# EAGLE design LCD_I2C (EAGLE 9.5.2)
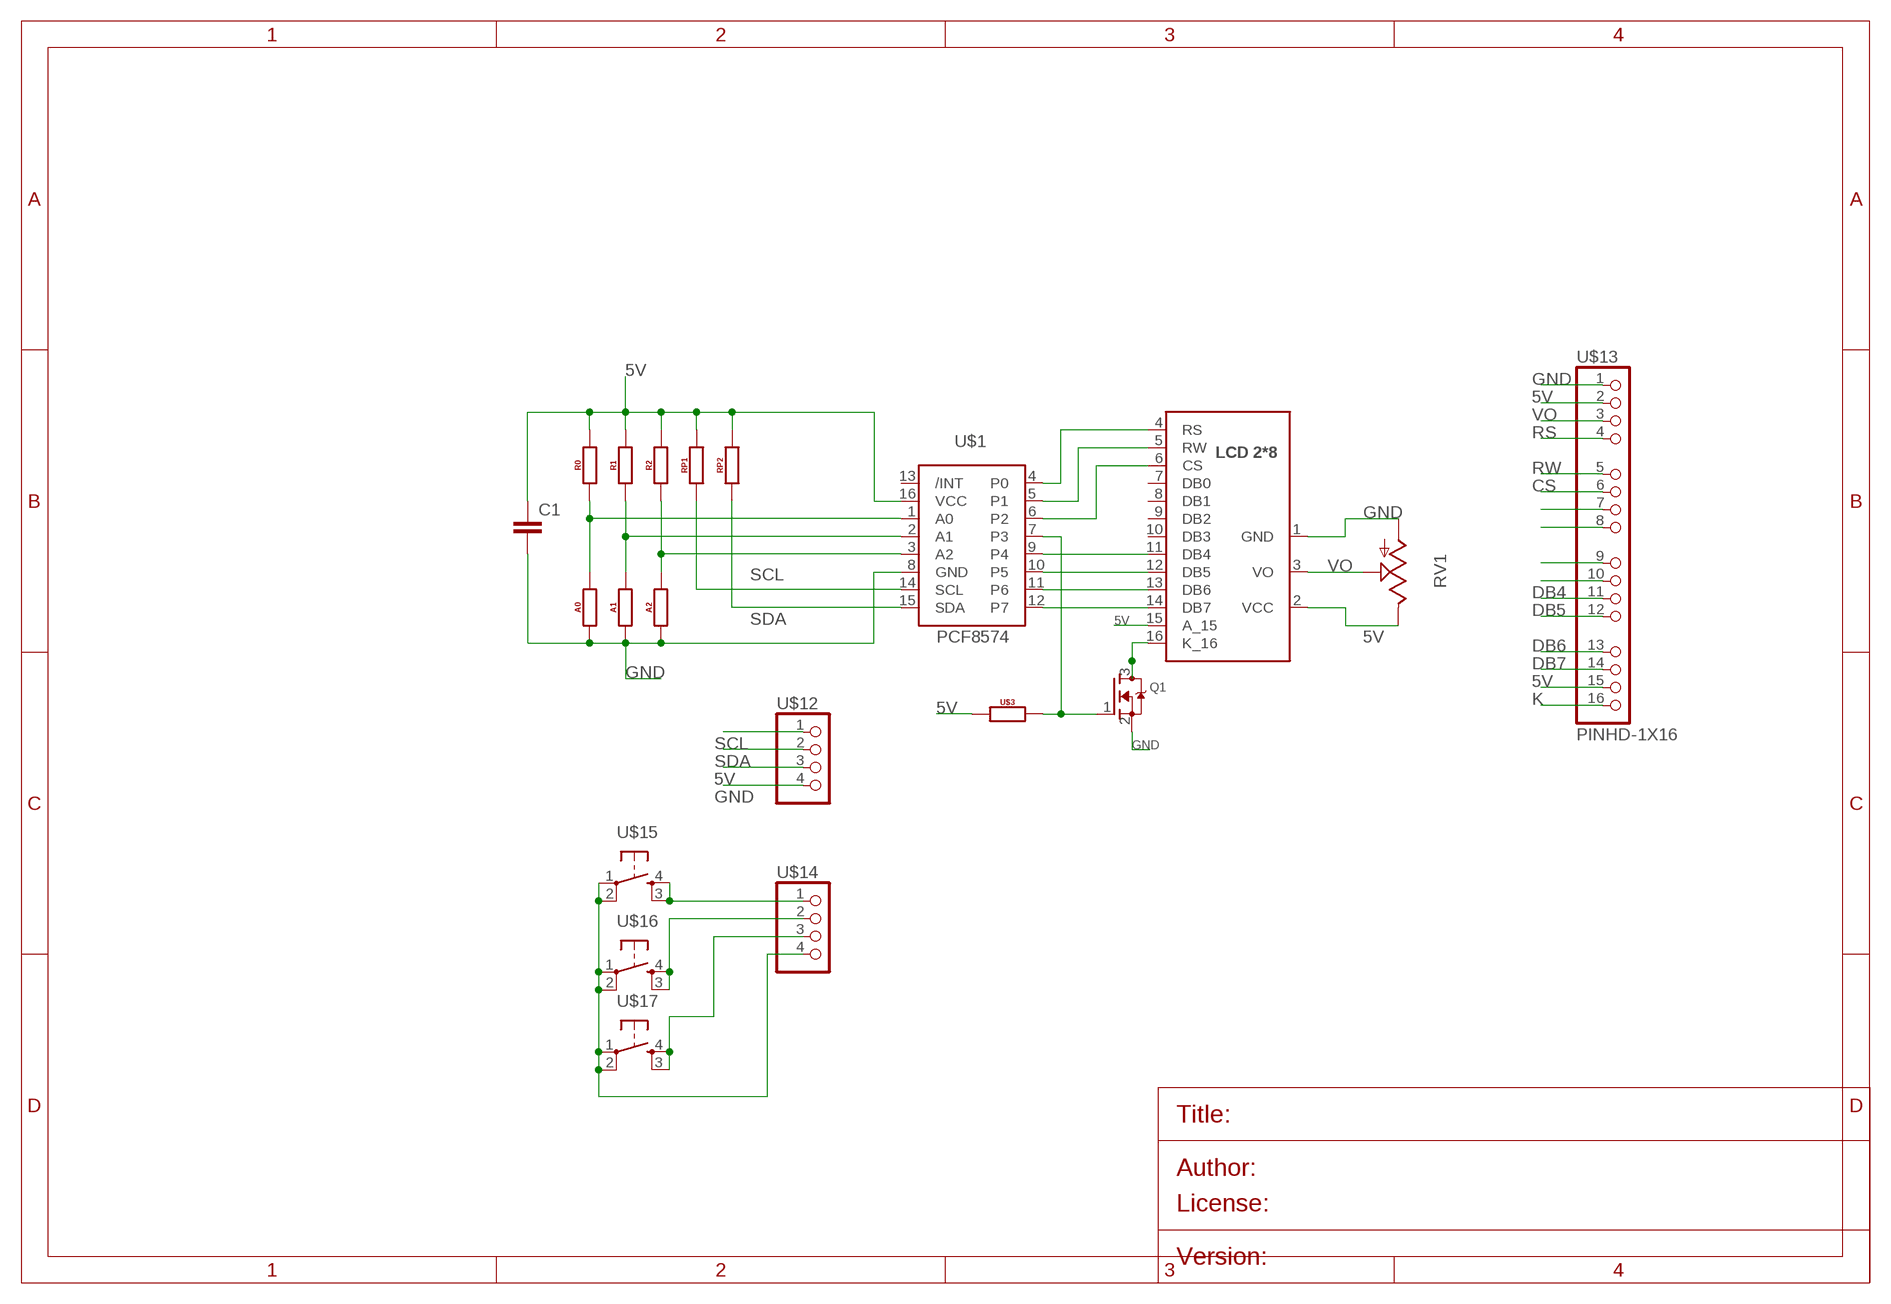
[diagram p0: schematic, sheet 1]

## Parts
A0  RESISTOR0805  [0805]
A1  RESISTOR0805  [0805]
A2  RESISTOR0805  [0805]
C1  CAPACITOR0805  [0805]
Q1  MOSFET-N  [SOT23-WIDE]
R0  RESISTOR0805  [0805]
R1  RESISTOR0805  [0805]
R2  RESISTOR0805  [0805]
RP1  RESISTOR0805  [0805]
RP2  RESISTOR0805  [0805]
RV1  TRIM_POTB25P  [B25P]
U$1  PCF8574  [SOIC16]
U$2  LCD_28_A  [LCD_2*8_A]
U$3  RESISTOR0805  [0805]
U$12  PINHD-1X4_NO_SILK  [1X04_NO_SILK]
U$13  PINHD-1X16  [1X16_NO_SILK]
U$14  PINHD-1X4_NO_SILK  [1X04_NO_SILK]
U$15  TACTILE_BUTTON_SMD  [TACTILE-BUTTON-SMD]
U$16  TACTILE_BUTTON_SMD  [TACTILE-BUTTON-SMD]
U$17  TACTILE_BUTTON_SMD  [TACTILE-BUTTON-SMD]

## Nets
5V [PWR]: C1.1 R0.2 R1.2 R2.2 RP1.2 RP2.2 RV1.E U$1.16(VCC) U$2.2(VCC) U$2.15(A_15) U$3.1 U$12.3 U$13.2 U$13.15
CS: U$1.6(P2) U$2.6(CS) U$13.6
DB4: U$1.9(P4) U$2.11(DB4) U$13.11
DB5: U$1.10(P5) U$2.12(DB5) U$13.12
DB6: U$1.11(P6) U$2.13(DB6) U$13.13
DB7: U$1.12(P7) U$2.14(DB7) U$13.14
GND [PWR]: A0.1 A1.1 A2.1 C1.2 Q1.2(S) RV1.A U$1.8(GND) U$2.1(GND) U$12.4 U$13.1
K: Q1.3(D) U$2.16(K_16) U$13.16
N$1: U$14.4 U$15.1(SWA1) U$15.2(SWB1) U$16.1(SWA1) U$16.2(SWB1) U$17.1(SWA1) U$17.2(SWB1)
N$2: U$14.1 U$15.3(SWB2) U$15.4(SWA2)
N$3: U$14.2 U$16.3(SWB2) U$16.4(SWA2)
N$4: A0.2 R0.1 U$1.1(A0)
N$5: U$14.3 U$17.3(SWB2) U$17.4(SWA2)
N$10: Q1.1(G) U$1.7(P3) U$3.2
N$11: A1.2 R1.1 U$1.2(A1)
N$13: A2.2 R2.1 U$1.3(A2)
N$20: U$13.7
N$21: U$13.8
N$22: U$13.9
N$23: U$13.10
RS: U$1.4(P0) U$2.4(RS) U$13.4
RW: U$1.5(P1) U$2.5(RW) U$13.5
SCL: RP1.1 U$1.14(SCL) U$12.1
SDA: RP2.1 U$1.15(SDA) U$12.2
VO: RV1.S U$2.3(VO) U$13.3
Unconnected: U$1.13(/INT) U$2.7(DB0) U$2.8(DB1) U$2.9(DB2) U$2.10(DB3)

## Library data of the parts
A0 A1 A2 R0 R1 R2 RP1 RP2 U$3 = flash_pow3:RESISTOR: Generic EU resistor symbol
C1 = flash_pow3:CAPACITOR: CAPACITOR, European symbol
Q1 = flash_pow3:MOSFET-N: N-Channel Mosfet 2N7002E - 60V 260mA SOT23 [Digikey: 2N7002ET1GOSTR-ND] - REEL BSH103 - 30V 850mA SOT23 [Digikey: 568-5013-1-ND]
RV1 = flash_pow3:TRIM_POT: POTENTIOMETER
U$1 = flash_pow3:PCF8574: Remote 8-Bit I/O Expander for I²C Bus
U$2 = flash_pow3:LCD_2*8_A: LCD WINSTAR 2x8 with controller. (Pads 1 to 16 are spaced symmetrically by horizontal axis)
U$12 U$14 = flash_pow3:PINHD-1X4
U$13 = flash_pow3:PINHD-1X16
U$15-U$17 = flash_pow3:TACTILE_BUTTON: Tactile Button SparkFun Electronics' Tactile Button COM-10302

## Net classes
1 PWR: width 0.3 mm

## Board
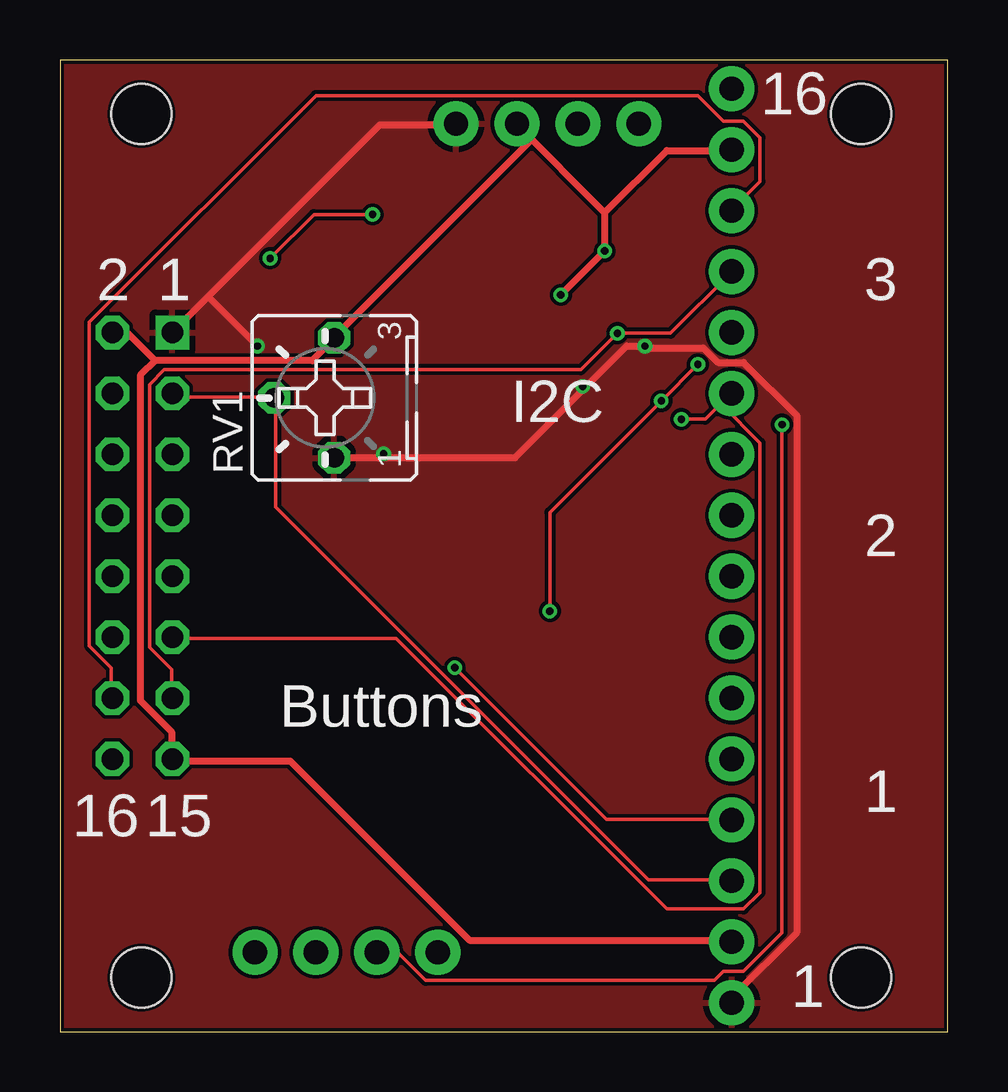
[diagram p1: board, top side]
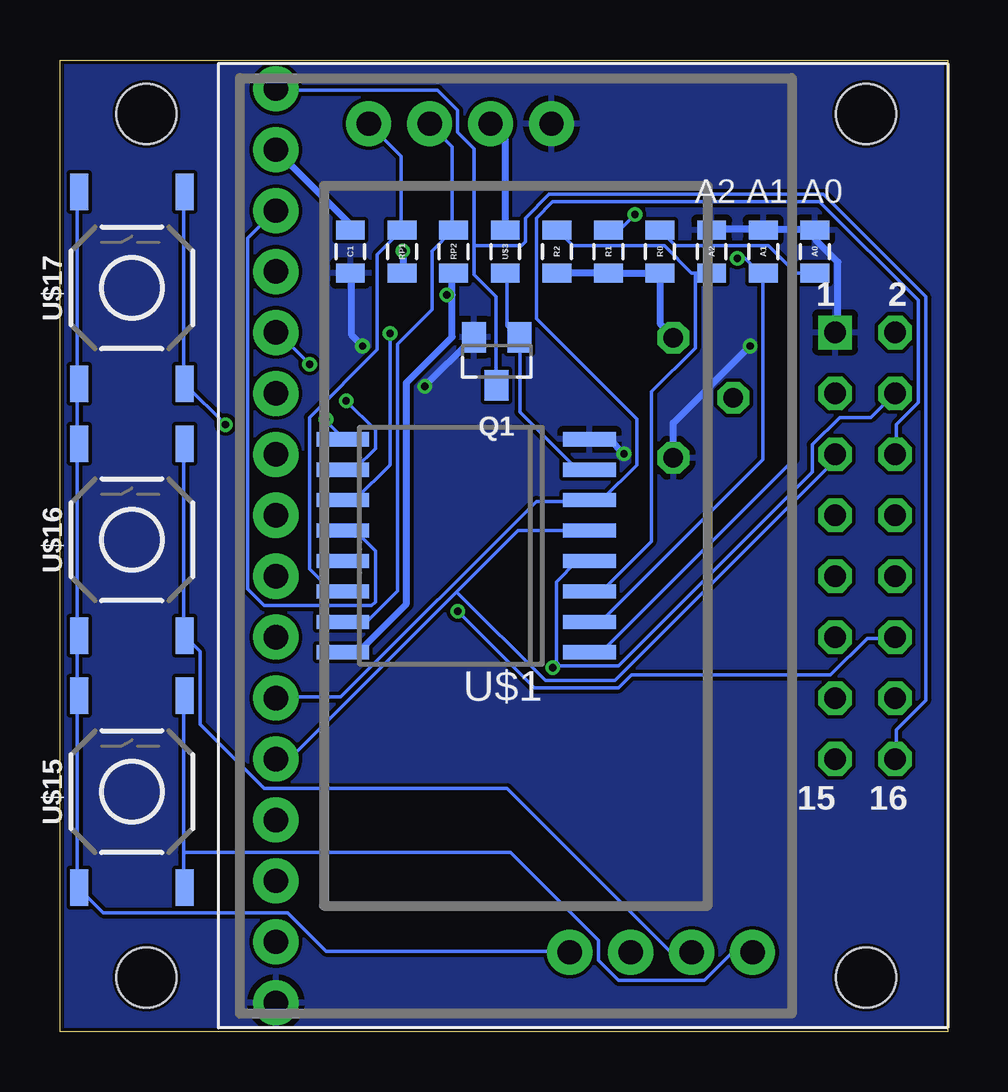
[diagram p2: board, bottom side, seen from below]

Size 37 x 40.5 mm. Coordinates in mm from the lower left corner, seen from the top.
Outline: 0,0 37,0 37,40.5 0,40.5 0,0
Copper layers (1*16): Top 0.035mm / dielectric 1.5mm / Bottom 0.035mm
Design rules "flash_boards.v281218": minimum track width 6mil, minimum drill 12mil, track to track 6mil, track to pad 6mil, pad to pad 6mil, via to via 6mil, smd to smd 0mil, copper to edge 6mil, drill to drill 6mil, minimum pad ring 10mil, minimum via ring 6mil, stop-mask expansion 2mil, vias tented up to drill 25mil, thermal gap 10mil

### Footprints (pad centres in the part's own frame; a part is rotated, then mirrored left to right if it is on the bottom)
0805 = smd 0.8 x 1.2: 1 -0.9,0; 2 0.9,0
SOT23-WIDE = smd 1 x 1.27: 1 -0.95,-1; 2 0.95,-1; 3 0,1
B25P = drill 0.813 octagon: A -2.5,0; E 2.5,0; S 0,2.5
SOIC16 = smd 0.6 x 2.2: 1 -4.445,-5.14; 2 -3.175,-5.14; 3 -1.905,-5.14; 4 -0.635,-5.14; 5 0.635,-5.14; 6 1.905,-5.14; 7 3.175,-5.14; 8 4.445,-5.14; 9 4.445,5.14; 10 3.175,5.14; 11 1.905,5.14; 12 0.635,5.14; 13 -0.635,5.14; 14 -1.905,5.14; 15 -3.175,5.14; 16 -4.445,5.14
LCD_2*8_A = drill 0.9 square: 1 -8.89,13.316 | drill 0.9 octagon: 2 -8.89,15.816; 3 -6.35,13.316; 4 -6.35,15.816; 5 -3.81,13.316; 6 -3.81,15.816; 7 -1.27,13.316; 8 -1.27,15.816; 9 1.27,13.316; 10 1.27,15.816; 11 3.81,13.316; 12 3.81,15.816; 13 6.35,13.316; 14 6.35,15.816; 15 8.89,13.316; 16 8.89,15.816 | hole 2.5: -18,14.605; -18,-15.395; 18,14.605; 18,-15.395
1X04_NO_SILK = drill 1.016 pad 1.88: 1 -3.81,0; 2 -1.27,0; 3 1.27,0; 4 3.81,0
1X16_NO_SILK = drill 1.016 pad 1.88: 1 -19.05,0; 2 -16.51,0; 3 -13.97,0; 4 -11.43,0; 5 -8.89,0; 6 -6.35,0; 7 -3.81,0; 8 -1.27,0; 9 1.27,0; 10 3.81,0; 11 6.35,0; 12 8.89,0; 13 11.43,0; 14 13.97,0; 15 16.51,0; 16 19.05,0
TACTILE-BUTTON-SMD = smd 1.524 x 0.762: 1 -4,2.2; 2 4,2.2; 3 -4,-2.2; 4 4,-2.2

### Placement (x,y rotation side)
A0  5.53,32.51 270 bottom
A1  7.68,32.51 270 bottom
A2  9.83,32.51 270 bottom
C1  24.89,32.51 270 bottom
Q1  18.8,27.94 180 bottom
R0  11.99,32.51 270 bottom
R1  14.14,32.51 270 bottom
R2  16.29,32.51 270 bottom
RP1  22.74,32.51 270 bottom
RP2  20.59,32.51 270 bottom
RV1  11.43,26.42 90 top
U$1  20.07,20.25 90 bottom
U$2  18,20.25 270 bottom
U$3  18.44,32.51 270 bottom
U$12  20.32,37.85 180 top
U$13  28,20.25 90 top
U$14  11.94,3.3 0 top
U$15  34,10 90 bottom
U$16  34,20.5 90 bottom
U$17  34,31 90 bottom

### Tracks (layer width: path | path; a pad name or v marks a point on that pad's centre or on a via)
5V  (via drill 0.3)
  Top 0.3: 22.71,34.14 v22.71,32.54 v20.88,30.71 | 22.71,34.14 19.05,37.8 U$12.3 19.58,37.11 11.51,29.03 RV1.E 11.43,28.88 10.52,27.96 3.96,27.96 | 22.71,34.14 25.3,36.73 27.96,36.73 U$13.15 | 3.96,27.96 2.82,29.11 2.21,29.11 U$2.2 | 3.96,27.96 3.35,27.36 3.35,13.79 4.65,12.5 4.65,11.43 U$2.15 4.8,11.28 9.6,11.28 17.07,3.81 27.96,3.81 U$13.2
  Bottom 0.3: 20.65,30.71 20.65,28.96 22.55,27.05 22.55,17.83 24.54,15.85 25.15,15.85 U$1.16 | 20.65,30.71 20.65,31.55 RP2.2 | C1.1 24.92,33.45 24.92,33.68 27.96,36.73 U$13.15 | v22.71,32.54 22.71,31.62 RP1.2 | U$3.1 18.44,33.45 18.44,37.19 19.05,37.8 U$12.3 | R2.2 16.23,31.62 14.25,31.62 R1.2 14.1,31.62 12.04,31.62 R0.2 11.96,31.47 11.96,29.49 11.43,28.96 RV1.E | v20.88,30.71 20.65,30.71
CS
  Bottom 0.152: U$13.6 27.96,13.95 25.3,13.95 17.14,22.1 14.94,22.1 U$1.6 14.86,22.17 14.4,22.17 12.95,23.62 12.95,25.53 17.14,29.72 17.14,33.91 16.46,34.59 5.33,34.59 1.22,30.48 1.22,26.21 2.13,25.3 2.13,24.08 U$2.6
DB4  (via drill 0.3)
  Top 0.152: v25.91,25.53 26.9,25.53 27.96,26.59 U$13.11 27.58,26.14 29.18,24.54 29.18,5.79 28.5,5.11 25.3,5.11 14.02,16.38 4.72,16.38 U$2.11
  Bottom 0.152: v25.91,25.53 25.91,25.45 25.22,24.77 U$1.9
DB5  (via drill 0.3)
  Top 0.152: v26.59,27.81 v25.07,26.29 20.42,21.64 v20.42,17.53
  Bottom 0.152: v25.07,26.29 23.85,25.07 23.85,24.31 24.69,23.47 25.15,23.47 U$1.10 | v26.59,27.81 27.96,29.18 U$13.12 | v20.42,17.53 17.22,14.33 13.72,14.33 13.18,14.86 4.88,14.86 3.35,16.38 2.21,16.38 U$2.12
DB6  (via drill 0.3)
  Top 0.152: U$13.13 27.96,31.62 25.45,29.11 v23.24,29.11 21.72,27.58 4.34,27.58 3.73,26.98 3.73,16 4.65,15.09 4.65,13.95 U$2.13
  Bottom 0.152: v23.24,29.11 23.24,23.62 24.69,22.17 25.15,22.17 U$1.11
DB7
  Top 0.152: U$2.14 2.13,13.95 2.13,15.16 1.22,16.08 1.22,29.57 10.67,39.01 26.59,39.01 27.66,37.95 28.5,37.95 29.18,37.26 29.18,35.43 28.04,34.29 U$13.14
  Bottom 0.152: U$1.12 25.15,20.88 24.69,20.88 23.85,20.04 23.85,17.91 24,17.75 28.5,17.75 29.18,18.44 29.18,33.07 28.04,34.21 U$13.14
GND  (via drill 0.3)
  Top 0.3: 6.17,30.63 4.72,29.18 U$2.1 | 6.17,30.63 13.34,37.8 16.46,37.8 U$12.4 | 21.87,26.82 18.97,23.93 13.49,23.93 | 21.87,26.82 23.62,28.57 v24.38,28.57 24.46,28.5 26.82,28.5 27.43,27.89 28.5,27.89 30.71,25.68 30.71,4.12 28.04,1.45 28.04,1.22 U$13.1 | 13.49,23.93 RV1.A | v21.79,26.9 21.87,26.82 | v13.49,24.08 13.49,23.93 | v8.23,28.57 6.17,30.63
  Bottom 0.3: A2.1 9.83,33.45 7.77,33.45 A1.1 7.62,33.45 5.56,33.45 A0.1 5.49,33.3 5.49,32.99 4.57,32.08 4.57,29.26 4.65,29.18 U$2.1 | v24.38,28.57 24.84,29.03 24.84,31.55 C1.2 | v21.79,26.9 19.81,28.88 Q1.2 | v13.49,24.08 14.1,24.69 14.86,24.69 U$1.8 | v8.23,28.57 11.43,25.38 RV1.A
  pour Top: 37.08,40.64 0,40.64 0,0.51 -0.51,0 37.08,0
  pour Bottom: 37.08,40.64 0.51,40.64 0,40.13 0,0 37.08,0
K
  Bottom 0.152: 19.74,32.77 19.74,36.8 20.42,37.49 20.42,38.41 21.26,39.24 27.96,39.24 U$13.16 | 19.74,32.77 19.74,31.55 18.82,30.63 18.82,26.98 Q1.3 | 19.74,32.77 17.75,32.77 17.6,32.92 17.6,33.91 16.61,34.9 5.18,34.9 0.91,30.63 0.91,13.79 2.13,12.57 2.13,11.43 U$2.16
N$1
  Bottom 0.152: U$17.2 36.27,34.98 36.27,27.05 U$17.1 36.27,26.98 36.27,24.54 U$16.2 36.27,24.46 36.27,16.54 U$16.1 36.27,16.46 36.27,14.02 U$15.2 36.27,13.95 36.27,6.02 U$15.1 36.2,5.94 35.2,4.95 27.51,4.95 25.91,3.35 15.77,3.35 U$14.4
N$2
  Bottom 0.152: 31.85,7.47 31.85,13.95 U$15.4 | 31.85,7.47 31.85,6.02 U$15.3 | 31.85,7.47 18.21,7.47 14.55,3.81 14.55,2.97 13.72,2.13 10.13,2.13 8.99,3.28 8.15,3.28 U$14.1
N$3
  Bottom 0.152: U$16.4 31.85,24.46 31.85,16.54 U$16.3 31.77,16.46 31.17,15.85 31.17,12.8 28.5,10.13 18.36,10.13 11.58,3.35 10.67,3.35 U$14.2
N$4
  Bottom 0.152: 6.36,31.66 7.47,32.77 11.35,32.77 11.96,33.38 R0.1 | 6.36,31.66 6.33,31.62 5.56,31.62 A0.2 | U$1.1 14.86,15.85 14.4,15.85 6.4,23.85 6.4,31.62 6.36,31.66
N$5  (via drill 0.3)
  Top 0.152: v30.1,25.3 30.1,4.12 28.5,2.52 27.66,2.52 27.28,2.13 15.24,2.13 14.1,3.28 13.26,3.28 U$14.3
  Bottom 0.152: U$17.4 31.85,34.98 31.85,27.05 U$17.3 31.77,26.98 v30.1,25.3
N$10
  Bottom 0.152: U$3.2 18.36,31.55 18.36,29.41 17.91,28.96 Q1.1 17.83,28.88 17.83,25.83 15.47,23.47 14.94,23.47 U$1.7
N$11  (via drill 0.3)
  Top 0.152: v13.03,34.06 10.59,34.06 v8.76,32.23
  Bottom 0.152: U$1.2 14.86,17.14 14.4,17.14 7.7,23.85 7.7,31.55 A1.2 7.77,31.55 8.46,32.23 v8.76,32.23 | v13.03,34.06 13.64,33.45 14.1,33.45 R1.1
N$13
  Bottom 0.152: 10.52,31.62 10.67,31.62 11.81,32.77 15.62,32.77 16.23,33.38 R2.1 | 10.52,31.62 9.91,31.62 A2.2 | 10.52,31.62 10.52,28.5 12.34,26.67 12.34,20.42 14.4,18.36 14.86,18.36 U$1.3
RS  (via drill 0.3)
  Top 0.152: v16.46,15.16 22.78,8.84 27.96,8.84 U$13.4
  Bottom 0.152: 16.27,15.35 16.15,15.24 13.72,15.24 5.64,23.32 5.64,24.46 4.5,25.6 3.2,25.6 2.21,26.59 U$2.4 | 16.27,15.35 16.31,15.39 16.31,18.75 15.47,19.58 14.94,19.58 U$1.4 | 16.27,15.35 v16.46,15.16
RW
  Bottom 0.152: 20.46,18.33 27.36,11.43 27.96,11.43 U$13.5 | 20.46,18.33 17.91,20.88 U$1.5 | 20.46,18.33 16.76,14.63 13.87,14.63 4.72,23.77 4.72,24 U$2.5
SCL
  Bottom 0.152: U$12.1 22.78,36.5 22.78,33.45 RP1.1 22.78,33.38 23.77,32.38 23.77,28.42 26.59,25.6 26.59,19.28 25.68,18.36 25.22,18.36 U$1.14
SDA
  Bottom 0.152: U$12.2 21.57,37.8 20.65,36.88 20.65,33.45 RP2.1 20.65,33.38 21.49,32.54 21.49,30.1 22.94,28.65 22.94,18.36 24.16,17.14 25.15,17.14 U$1.15
VO
  Top 0.152: U$2.3 4.72,26.59 4.88,26.44 8.91,26.44 RV1.S 8.99,26.36 8.99,21.87 24.54,6.33 27.96,6.33 U$13.3

### Text on the board
_tNames: 16 | 2 | 1 | 3 | I2C | 2 | Buttons | 1 | 16 | 15 | 1
_bNames: A0 | A1 | A2